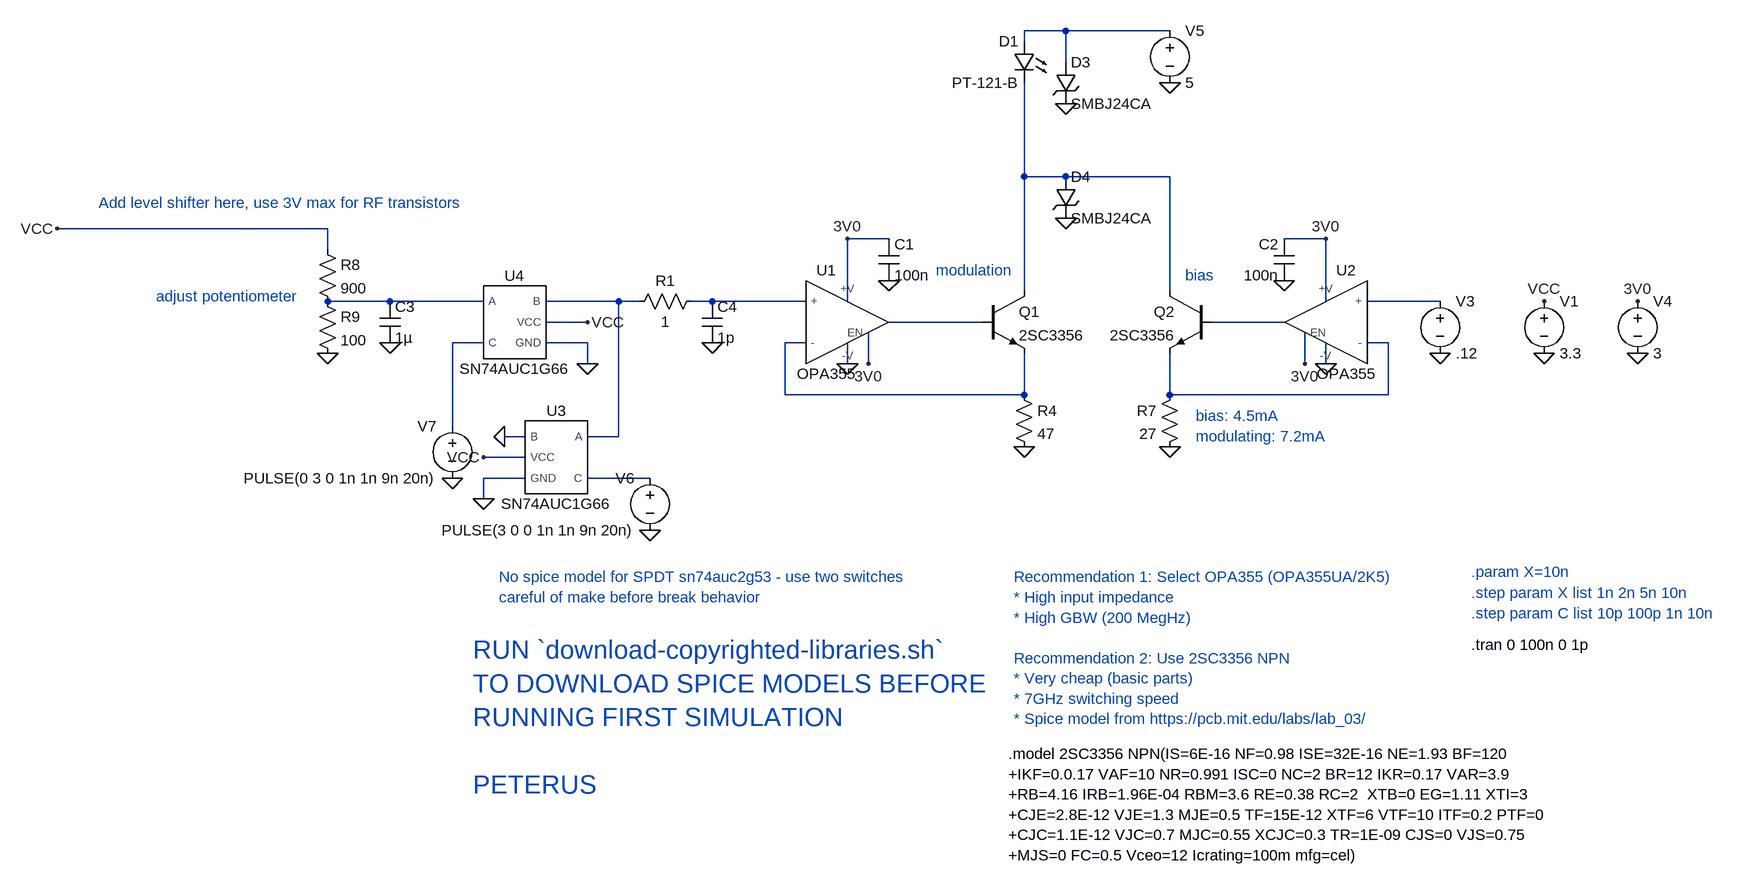
[diagram p0: schematic AAA_transmitter_laser_driver_simulation.asc]
AAA_transmitter_laser_driver_simulation.asc, the LTspice schematic file:
Version 4
SHEET 1 5336 1412
WIRE -64 -864 -128 -864
WIRE 96 -864 -64 -864
WIRE -128 -848 -128 -864
WIRE -64 -816 -64 -864
WIRE -128 -640 -128 -784
WIRE -64 -640 -128 -640
WIRE 96 -640 -64 -640
WIRE -1200 -560 -1616 -560
WIRE -336 -544 -400 -544
WIRE 336 -544 272 -544
WIRE -1200 -528 -1200 -560
WIRE -128 -464 -128 -640
WIRE 96 -464 96 -640
WIRE -1104 -448 -1200 -448
WIRE -960 -448 -1104 -448
WIRE -752 -448 -864 -448
WIRE -720 -448 -752 -448
WIRE -608 -448 -640 -448
WIRE -464 -448 -608 -448
WIRE -400 -448 -400 -544
WIRE 336 -448 336 -544
WIRE 512 -448 400 -448
WIRE -800 -416 -864 -416
WIRE -192 -416 -336 -416
WIRE 272 -416 160 -416
WIRE -960 -384 -1008 -384
WIRE -800 -384 -864 -384
WIRE -464 -384 -496 -384
WIRE 432 -384 400 -384
WIRE -800 -352 -800 -384
WIRE -400 -352 -400 -384
WIRE -368 -352 -368 -400
WIRE 304 -352 304 -400
WIRE 336 -352 336 -384
WIRE -496 -304 -496 -384
WIRE -128 -304 -128 -368
WIRE -128 -304 -496 -304
WIRE 96 -304 96 -368
WIRE 432 -304 432 -384
WIRE 432 -304 96 -304
WIRE -1008 -256 -1008 -384
WIRE -896 -240 -928 -240
WIRE -752 -240 -752 -448
WIRE -752 -240 -800 -240
WIRE -896 -208 -960 -208
WIRE -896 -176 -960 -176
WIRE -704 -176 -800 -176
WIRE -960 -144 -960 -176
FLAG 672 -368 0
FLAG 672 -448 VCC
FLAG 816 -368 0
FLAG 816 -448 3V0
FLAG -400 -352 0
FLAG -336 -480 0
FLAG -368 -352 3V0
FLAG 336 -352 0
FLAG 272 -480 0
FLAG 304 -352 3V0
FLAG 512 -368 0
FLAG -1008 -176 0
FLAG -1200 -368 0
FLAG -400 -544 3V0
FLAG 336 -544 3V0
FLAG -64 -752 0
FLAG -64 -576 0
FLAG -128 -224 0
FLAG 96 -224 0
FLAG 96 -784 0
FLAG -1616 -560 VCC
FLAG -800 -352 0
FLAG -800 -416 VCC
FLAG -1104 -384 0
FLAG -928 -240 0
FLAG -704 -96 0
FLAG -960 -144 0
FLAG -960 -208 VCC
FLAG -608 -384 0
SYMBOL voltage 672 -464 R0
WINDOW 123 0 0 Left 0
WINDOW 39 0 0 Left 0
SYMATTR InstName V1
SYMATTR Value 3.3
SYMBOL voltage 816 -464 R0
WINDOW 123 0 0 Left 0
WINDOW 39 0 0 Left 0
SYMATTR InstName V4
SYMATTR Value 3
SYMBOL res -144 -320 R0
SYMATTR InstName R4
SYMATTR Value 47
SYMBOL cap -352 -544 R0
SYMATTR InstName C1
SYMATTR Value 100n
SYMBOL OPA355 -432 -416 R0
SYMATTR InstName U1
SYMBOL res 112 -320 M0
SYMATTR InstName R7
SYMATTR Value 27
SYMBOL cap 288 -544 M0
SYMATTR InstName C2
SYMATTR Value 100n
SYMBOL OPA355 368 -416 M0
SYMATTR InstName U2
SYMBOL voltage 512 -464 R0
WINDOW 123 0 0 Left 0
WINDOW 39 0 0 Left 0
SYMATTR InstName V3
SYMATTR Value .12
SYMBOL voltage -1008 -272 M0
WINDOW 123 0 0 Left 0
WINDOW 39 0 0 Left 0
SYMATTR InstName V7
SYMATTR Value PULSE(0 3 0 1n 1n 9n 20n)
SYMBOL res -1216 -544 R0
SYMATTR InstName R8
SYMATTR Value 900
SYMBOL res -1216 -464 R0
SYMATTR InstName R9
SYMATTR Value 100
SYMBOL npn -192 -464 R0
SYMATTR InstName Q1
SYMATTR Value 2SC3356
SYMBOL npn 160 -464 M0
SYMATTR InstName Q2
SYMATTR Value 2SC3356
SYMBOL TVSdiode -80 -816 R0
SYMATTR InstName D3
SYMATTR Value SMBJ24CA
SYMBOL TVSdiode -80 -640 R0
SYMATTR InstName D4
SYMATTR Value SMBJ24CA
SYMBOL voltage 96 -880 R0
WINDOW 123 0 0 Left 0
WINDOW 39 0 0 Left 0
SYMATTR InstName V5
SYMATTR Value 5
SYMBOL LED -112 -848 M0
SYMATTR InstName D1
SYMATTR Value PT-121-B
SYMATTR Description Diode
SYMATTR Type diode
SYMBOL SN74AUC1G66 -912 -416 R0
SYMATTR InstName U4
SYMBOL cap -1120 -448 R0
SYMATTR InstName C3
SYMATTR Value 1µ
SYMBOL SN74AUC1G66 -848 -208 M0
SYMATTR InstName U3
SYMBOL voltage -704 -192 M0
WINDOW 123 0 0 Left 0
WINDOW 39 0 0 Left 0
SYMATTR InstName V6
SYMATTR Value PULSE(3 0 0 1n 1n 9n 20n)
SYMBOL res -624 -464 R90
WINDOW 0 0 56 VBottom 2
WINDOW 3 32 56 VTop 2
SYMATTR InstName R1
SYMATTR Value 1
SYMBOL cap -624 -448 R0
SYMATTR InstName C4
SYMATTR Value 1p
TEXT 560 80 Left 2 !.tran 0 100n 0 1p
TEXT 560 -32 Left 2 ;.param X=10n
TEXT 560 0 Left 2 ;.step param X list 1n 2n 5n 10n
TEXT 560 32 Left 2 ;.step param C list 10p 100p 1n 10n
TEXT -144 -24 Left 2 ;Recommendation 1: Select OPA355 (OPA355UA/2K5)\n* High input impedance\n* High GBW (200 MegHz)\n \nRecommendation 2: Use 2SC3356 NPN\n* Very cheap (basic parts)\n* 7GHz switching speed\n* Spice model from https://pcb.mit.edu/labs/lab_03/
TEXT -152 248 Left 2 !.model 2SC3356 NPN(IS=6E-16 NF=0.98 ISE=32E-16 NE=1.93 BF=120 \n+IKF=0.0.17 VAF=10 NR=0.991 ISC=0 NC=2 BR=12 IKR=0.17 VAR=3.9 \n+RB=4.16 IRB=1.96E-04 RBM=3.6 RE=0.38 RC=2  XTB=0 EG=1.11 XTI=3 \n+CJE=2.8E-12 VJE=1.3 MJE=0.5 TF=15E-12 XTF=6 VTF=10 ITF=0.2 PTF=0 \n+CJC=1.1E-12 VJC=0.7 MJC=0.55 XCJC=0.3 TR=1E-09 CJS=0 VJS=0.75 \n+MJS=0 FC=0.5 Vceo=12 Icrating=100m mfg=cel)
TEXT -1552 -600 Left 2 ;Add level shifter here, use 3V max for RF transistors
TEXT -936 -24 Left 2 ;No spice model for SPDT sn74auc2g53 - use two switches\ncareful of make before break behavior
TEXT 120 -488 Left 2 ;bias
TEXT -264 -496 Left 2 ;modulation
TEXT -976 88 Left 4 ;RUN `download-copyrighted-libraries.sh`\nTO DOWNLOAD SPICE MODELS BEFORE\nRUNNING FIRST SIMULATION\n \nPETERUS
TEXT 136 -272 Left 2 ;bias: 4.5mA\nmodulating: 7.2mA
TEXT -1464 -456 Left 2 ;adjust potentiometer

The netlist it stands for:
* AAA_transmitter_laser_driver_simulation.asc
V1 VCC 0 3.3
V4 3V0 0 3
R4 N010 0 47
C1 3V0 0 100n
XU1 N007 0 N005 N010 3V0 3V0 OPA355  ; pins OUT -V + - EN +V
R7 N011 0 27
C2 3V0 0 100n
XU2 N008 0 N006 N011 3V0 3V0 OPA355  ; pins OUT -V + - EN +V
V3 N006 0 .12
V7 N009 0 PULSE(0 3 0 1n 1n 9n 20n)
R8 VCC N003 900
R9 N003 0 100
Q1 N002 N007 N010 0 2SC3356
Q2 N002 N008 N011 0 2SC3356
D3 N001 0 SMBJ24CA
D4 N002 0 SMBJ24CA
V5 N001 0 5
D1 N001 N002 PT-121-B
XU4 N003 N004 N009 VCC 0 SN74AUC1G66  ; pins A B C VCC GND
C3 N003 0 1µ
XU3 N004 0 N012 VCC 0 SN74AUC1G66  ; pins A B C VCC GND
V6 N012 0 PULSE(3 0 0 1n 1n 9n 20n)
R1 N005 N004 1
C4 N005 0 1p
.model D D
.lib standard.dio
.model NPN NPN
.model PNP PNP
.lib standard.bjt
.tran 0 100n 0 1p
* .param X=10n
* .step param X list 1n 2n 5n 10n
* .step param C list 10p 100p 1n 10n
* Recommendation 1: Select OPA355 (OPA355UA/2K5)
* * High input impedance
* * High GBW (200 MegHz)
* Recommendation 2: Use 2SC3356 NPN
* * Very cheap (basic parts)
* * 7GHz switching speed
* * Spice model from https://pcb.mit.edu/labs/lab_03/
.model 2SC3356 NPN(IS=6E-16 NF=0.98 ISE=32E-16 NE=1.93 BF=120
+IKF=0.0.17 VAF=10 NR=0.991 ISC=0 NC=2 BR=12 IKR=0.17 VAR=3.9
+RB=4.16 IRB=1.96E-04 RBM=3.6 RE=0.38 RC=2  XTB=0 EG=1.11 XTI=3
+CJE=2.8E-12 VJE=1.3 MJE=0.5 TF=15E-12 XTF=6 VTF=10 ITF=0.2 PTF=0
+CJC=1.1E-12 VJC=0.7 MJC=0.55 XCJC=0.3 TR=1E-09 CJS=0 VJS=0.75
+MJS=0 FC=0.5 Vceo=12 Icrating=100m mfg=cel)
* Add level shifter here, use 3V max for RF transistors
* No spice model for SPDT sn74auc2g53 - use two switches
* careful of make before break behavior
* bias
* modulation
* RUN `download-copyrighted-libraries.sh`
* TO DOWNLOAD SPICE MODELS BEFORE
* RUNNING FIRST SIMULATION
* PETERUS
* bias: 4.5mA
* modulating: 7.2mA
* adjust potentiometer
.lib OPA355.LIB
.lib sn74auc1g66.lib
.backanno
.end